# Altium project Aux-BMS.PrjPcb
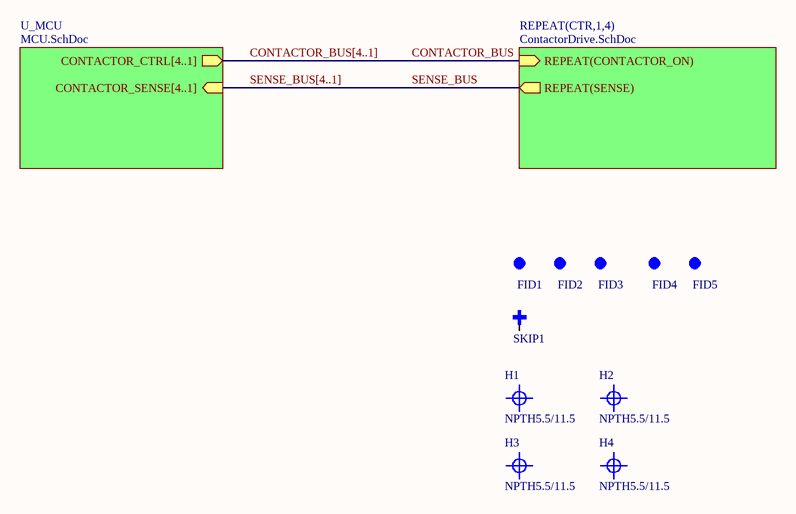
[diagram p0: MainSheet.SchDoc]
ProjectDocumentNumber: N/A; ProjectDrawnBy: DSG; ProjectOrganization: UofC Solar Car Team; ProjectRevHistory1: Initial Release; ProjectRevision: 1; ProjectStartDate: 2017-10-19; ProjectVersion: V01
3 sheets, 234 parts. Net scope: hierarchical (ports join the sheet entries above them; power ports are global).
Board file: Aux-BMS.PcbDoc
Sheets:
  MainSheet.SchDoc
    CTR1 = ContactorDrive.SchDoc
    CTR2 = ContactorDrive.SchDoc
    CTR3 = ContactorDrive.SchDoc
    CTR4 = ContactorDrive.SchDoc
    U_MCU = MCU.SchDoc

## Sheet MainSheet.SchDoc: Main
size A; SheetNumber: 1; SheetTotal: 3

### Parts
FID1  FIDUCIAL  [FID08]  (value not drawn)
FID2  FIDUCIAL  [FID08]  (value not drawn)
FID3  FIDUCIAL  [FID08]  (value not drawn)
FID4  FIDUCIAL  [FID08]  (value not drawn)
FID5  FIDUCIAL  [FID08]  (value not drawn)
H1  NPTH5.5/11.5  [NPTH5.5/11.5]  (no BOM)
H2  NPTH5.5/11.5  [NPTH5.5/11.5]  (no BOM)
H3  NPTH5.5/11.5  [NPTH5.5/11.5]  (no BOM)
H4  NPTH5.5/11.5  [NPTH5.5/11.5]  (no BOM)
SKIP1  X-Out/Skip Mark  [SKIP20-NOCOPPER]  (value not drawn)

### Sub-sheets
REPEAT(CTR,1,4) = ContactorDrive.SchDoc: REPEAT(CONTACTOR_ON) (in), REPEAT(SENSE) (out)
U_MCU = MCU.SchDoc: CONTACTOR_SENSE[4..1] (in), CONTACTOR_CTRL[4..1] (out)

### Nets

Not connected (* = marked no-connect by the designer): SKIP1 1

### Buses and harness runs
bus CONTACTOR_BUS[4..1] = sheet U_MCU/CONTACTOR_CTRL[4..1]
bus SENSE_BUS[4..1] = sheet U_MCU/CONTACTOR_SENSE[4..1]

### Notes on the sheet
- Revision History
- Rev:
- Description:
- Date:
- Title
- Size:
- Drawn By:
- D
- Number:
- Revision:
- Sheet
- of
- File:

### Library data of the parts
FID1-FID5 = FIDUCIAL: Alignment fiducial
H1-H4 = NPTH5.5/11.5: 5.5mm diameter hole, 11.5mm soldermask opening
SKIP1 = SKIP: X-Out/Skip Mark for bad board/do not populate

## Sheet ContactorDrive.SchDoc: Contactor Drive
size A; SheetNumber: 3; SheetTotal: 3
Used 4 times, as channels CTR1, CTR2, CTR3, CTR4. Parts and nets are listed once, with the designators drawn on the sheet.
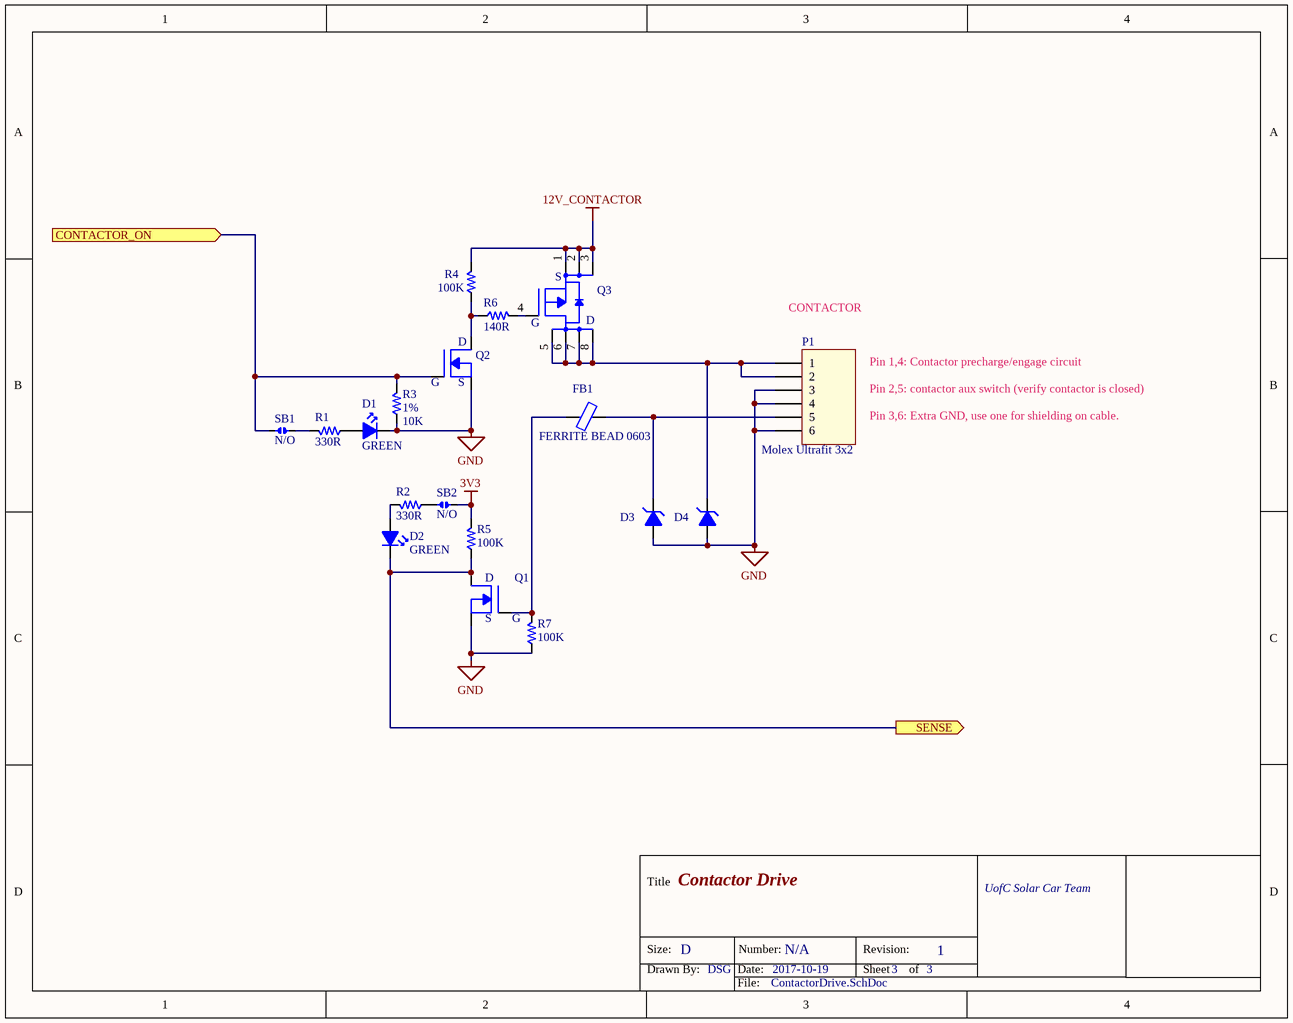
[diagram p1: ContactorDrive.SchDoc]

### Parts
D1  Color: GREEN  [SMD_0603_LED]  (hidden comment: D060-000G2-00)
D2  Color: GREEN  [SMD_0603_LED]  (hidden comment: D060-000G2-00)
D3  TVS_14V_UNI  [SODFL370X108-2N]  (value not drawn)
D4  TVS_14V_UNI  [SODFL370X108-2N]  (value not drawn)
FB1  FERRITE BEAD 0603  [INDC1608X10N]
P1  Molex Ultrafit 3x2  [Molex-Ultrafit-3x2]
Q1  NMOS - SSM3K333R  [NMOS - SSM3K333R - SOTFL95P180X88-3M]  (value not drawn)
Q2  NMOS - SSM3K333R  [NMOS - SSM3K333R - SOTFL95P180X88-3M]  (value not drawn)
Q3  INFINEON BSC030P03NS3 G  [BSC030P03NS3 G]  (value not drawn)
R1  value 330R  [PCB_GENERIC_SMD_0603]  (hidden comment: R060-00331-05)
R2  value 330R  [PCB_GENERIC_SMD_0603]  (hidden comment: R060-00331-05)
R3  value 10K  Tolerance: 1%  [PCB_GENERIC_SMD_0603]  (hidden comment: R060-00103-01)
R4  value 100K  [PCB_GENERIC_SMD_0603]  (hidden comment: R060-00104-05)
R5  value 100K  [PCB_GENERIC_SMD_0603]  (hidden comment: R060-00104-05)
R6  value 140R  [PCB_GENERIC_SMD_0603]  (hidden comment: R060-00141-05)
R7  value 100K  [PCB_GENERIC_SMD_0603]  (hidden comment: R060-00104-05)
SB1  N/O  [SB_ARROW_NC]  (no BOM)
SB2  N/O  [SB_ARROW_NC]  (no BOM)

### Ports
CONTACTOR_ON (in), SENSE (out)

### Nets
3V3: R5.2 SB2.2
12V_CONTACTOR: Q3.1(S) Q3.2(S) Q3.3(S) R4.2
GND: D1.1(K) D3.2(A) D4.2(A) P1.3 P1.4 P1.6 Q1.2(S) Q2.2(S) R3.1 R7.1
CONTACTOR_ON: Q2.1(G) R3.2 SB1.1 ; port CONTACTOR_ON
SENSE: D2.1(K) Q1.3(D) R5.1 ; port SENSE
NetD1_2: D1.2(A) R1.1
NetD2_2: D2.2(A) R2.2
NetD3_1: D3.1(C) FB1.2 P1.5
NetD4_1: D4.1(C) P1.1 P1.2 Q3.5(D) Q3.6(D) Q3.7(D) Q3.8(D)
NetFB1_1: FB1.1 Q1.1(G) R7.2
NetQ2_3: Q2.3(D) R4.1 R6.1
NetQ3_4: Q3.4(G) R6.2
NetR1_2: R1.2 SB1.2
NetR2_1: R2.1 SB2.1

### Channels
CTR1: designators end in A; ports CONTACTOR_ON=CONTACTOR_BUS1 SENSE=SENSE1
CTR2: designators end in B; ports CONTACTOR_ON=CONTACTOR_BUS2 SENSE=SENSE2
CTR3: designators end in C; ports CONTACTOR_ON=CONTACTOR_BUS3 SENSE=SENSE3
CTR4: designators end in D; ports CONTACTOR_ON=CONTACTOR_BUS4 SENSE=SENSE4

### Notes on the sheet
- (near P1) CONTACTOR
- Pin 1,4: Contactor precharge/engage circuit
- Pin 2,5: contactor aux switch (verify contactor is closed)
- Pin 3,6: Extra GND, use one for shielding on cable.
- Title
- Size:
- Drawn By:
- D
- Date:
- Number:
- Revision:
- Sheet
- of
- File:

### Library data of the parts
D1 D2 = D060-000G2-00: LED 0603 GREEN 3.2Vf 20mA; Supplier 1: Digi-Key; Supplier Part Number 1: 732-4971-1-ND
D3 D4 = TVS_14V_UNI: TVS DIODE 14VWM 23.2VC SMF; Supplier 1: Digi-Key; Supplier Part Number 1: SMF14A-E3-08GICT-ND
FB1 = 0603_FERRITE_600Ohm: Ferrite Bead, 0603, 600Ohm @ 100MHz, 200mOhm DC; Supplier 1: Digi-Key; Supplier 2: Newark; Supplier Part Number 1: MH1608-601YCT-ND; Supplier Part Number 2: 87W5975
P1 = Molex-Ultrafit-3x2: Molex Ultrafit 3x2 - 172299-1206
Q1 Q2 = NMOS - SSM3K333R: MOSFET N CH 30V 6A 2-3Z1A; Supplier 1: Digi-Key; Supplier Part Number 1: SSM3K333RLFDKR-ND
Q3 = BSC030P03NS3 G: P-Channel 30V 25.4A (Ta), 100A (Tc) 2.5W (Ta), 125W (Tc) Surface Mount PG-TDSON-8; Supplier 1: Digi-Key; Supplier Part Number 1: BSC030P03NS3 GCT-ND
R1 R2 = R060-00331-05: RES 0603 330ohm 5% 63mW; Tolerance: 5%; Power: 63mW; Package: 0603
R3 = R060-00103-01: RES 0603 10K 1% 100mW; Power: 100mW; Package: 0603
R4 R5 R7 = R060-00104-05: RES 0603 100K 5% 63mW; Tolerance: 5%; Power: 63mW; Package: 0603
R6 = R060-00141-05: RES 0603 140ohm 5% 63mW; Tolerance: 5%; Power: 63mW; Package: 0603
SB1 SB2 = SB_NO: Solder Bridge, Normally Open

## Sheet MCU.SchDoc: MCU
size D; SheetNumber: 2; SheetTotal: 3
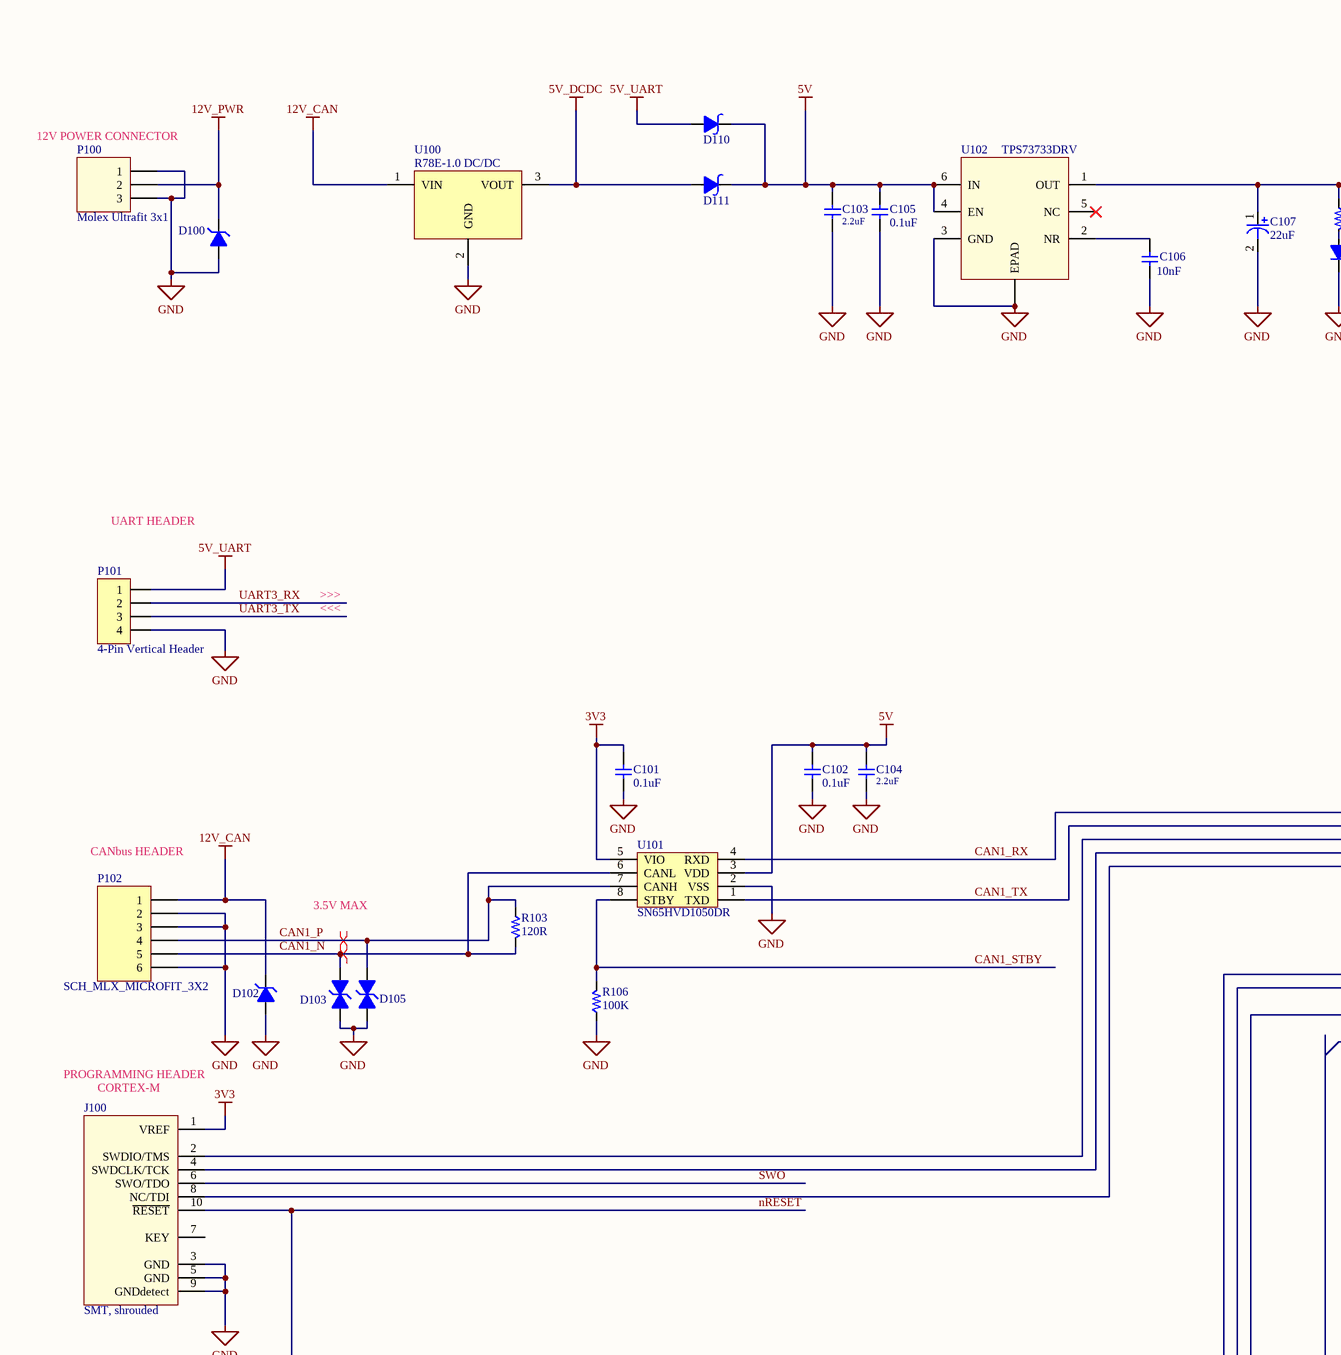
[diagram p2: MCU.SchDoc, top left]
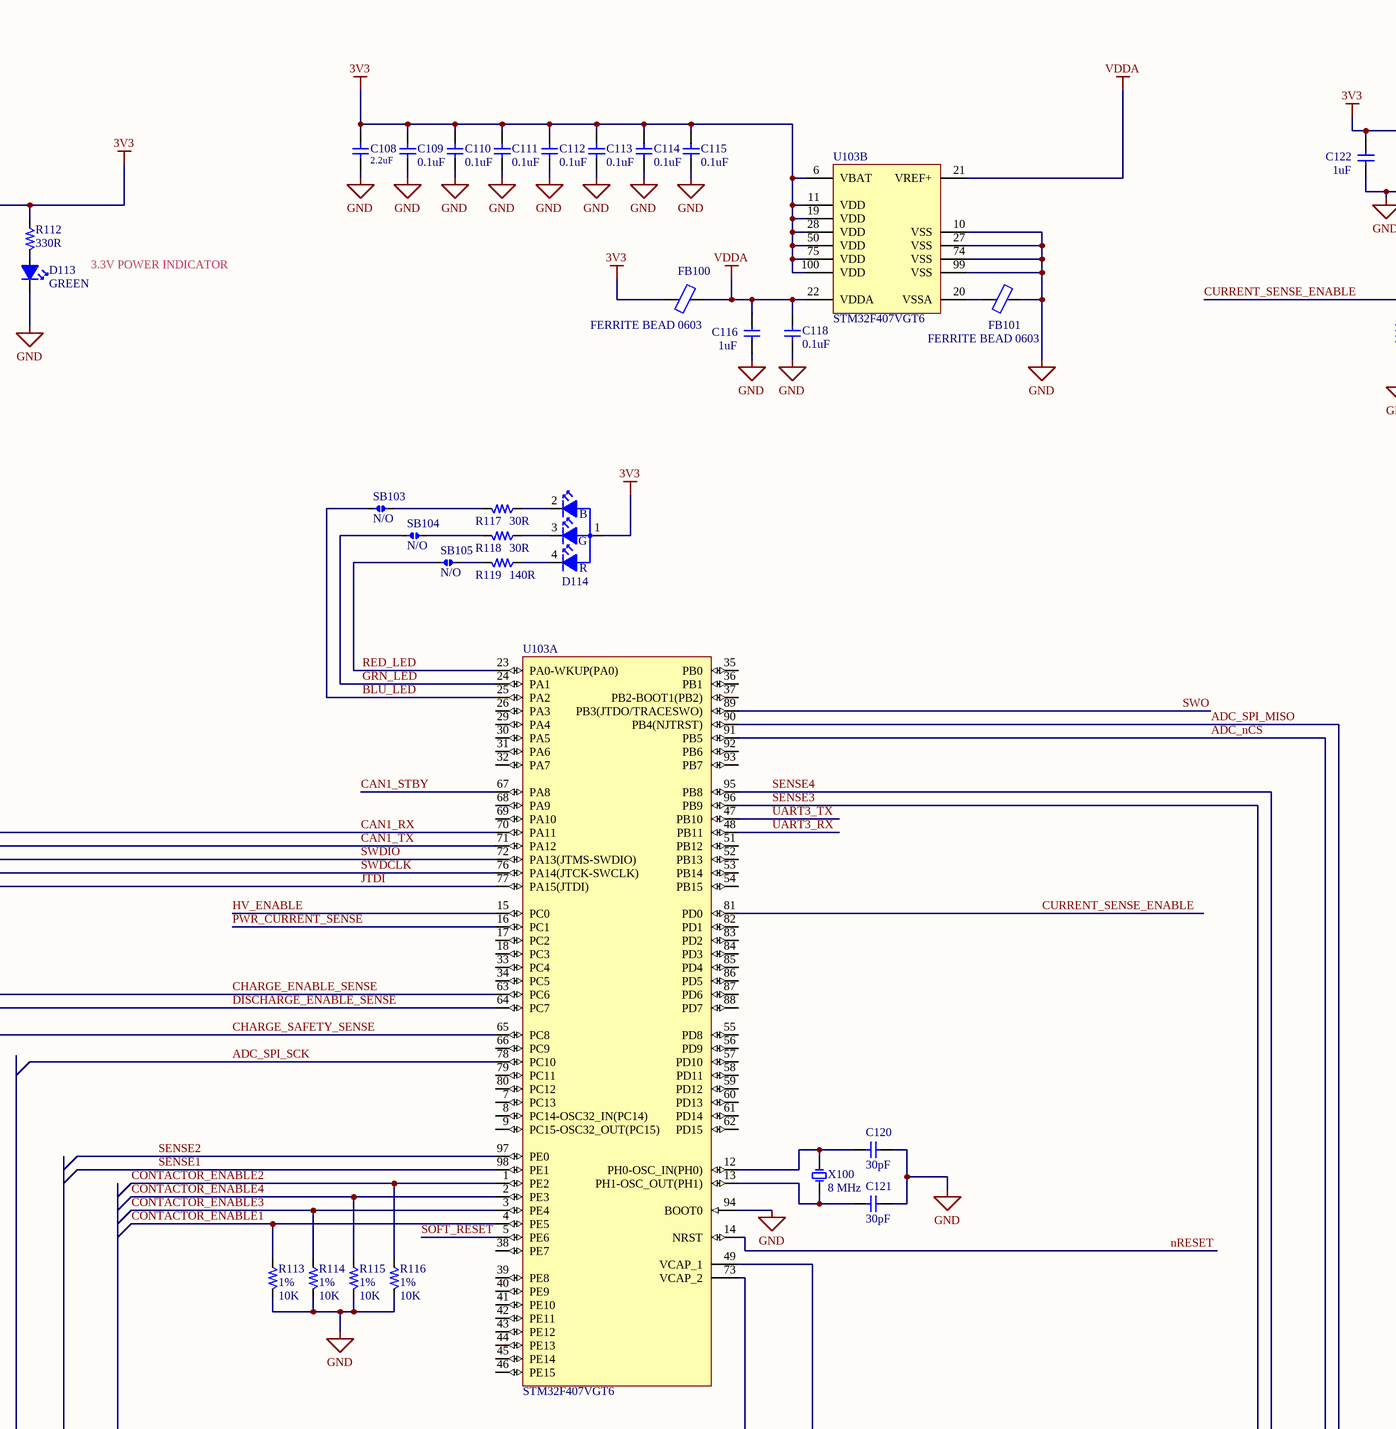
[diagram p3: MCU.SchDoc, top middle]
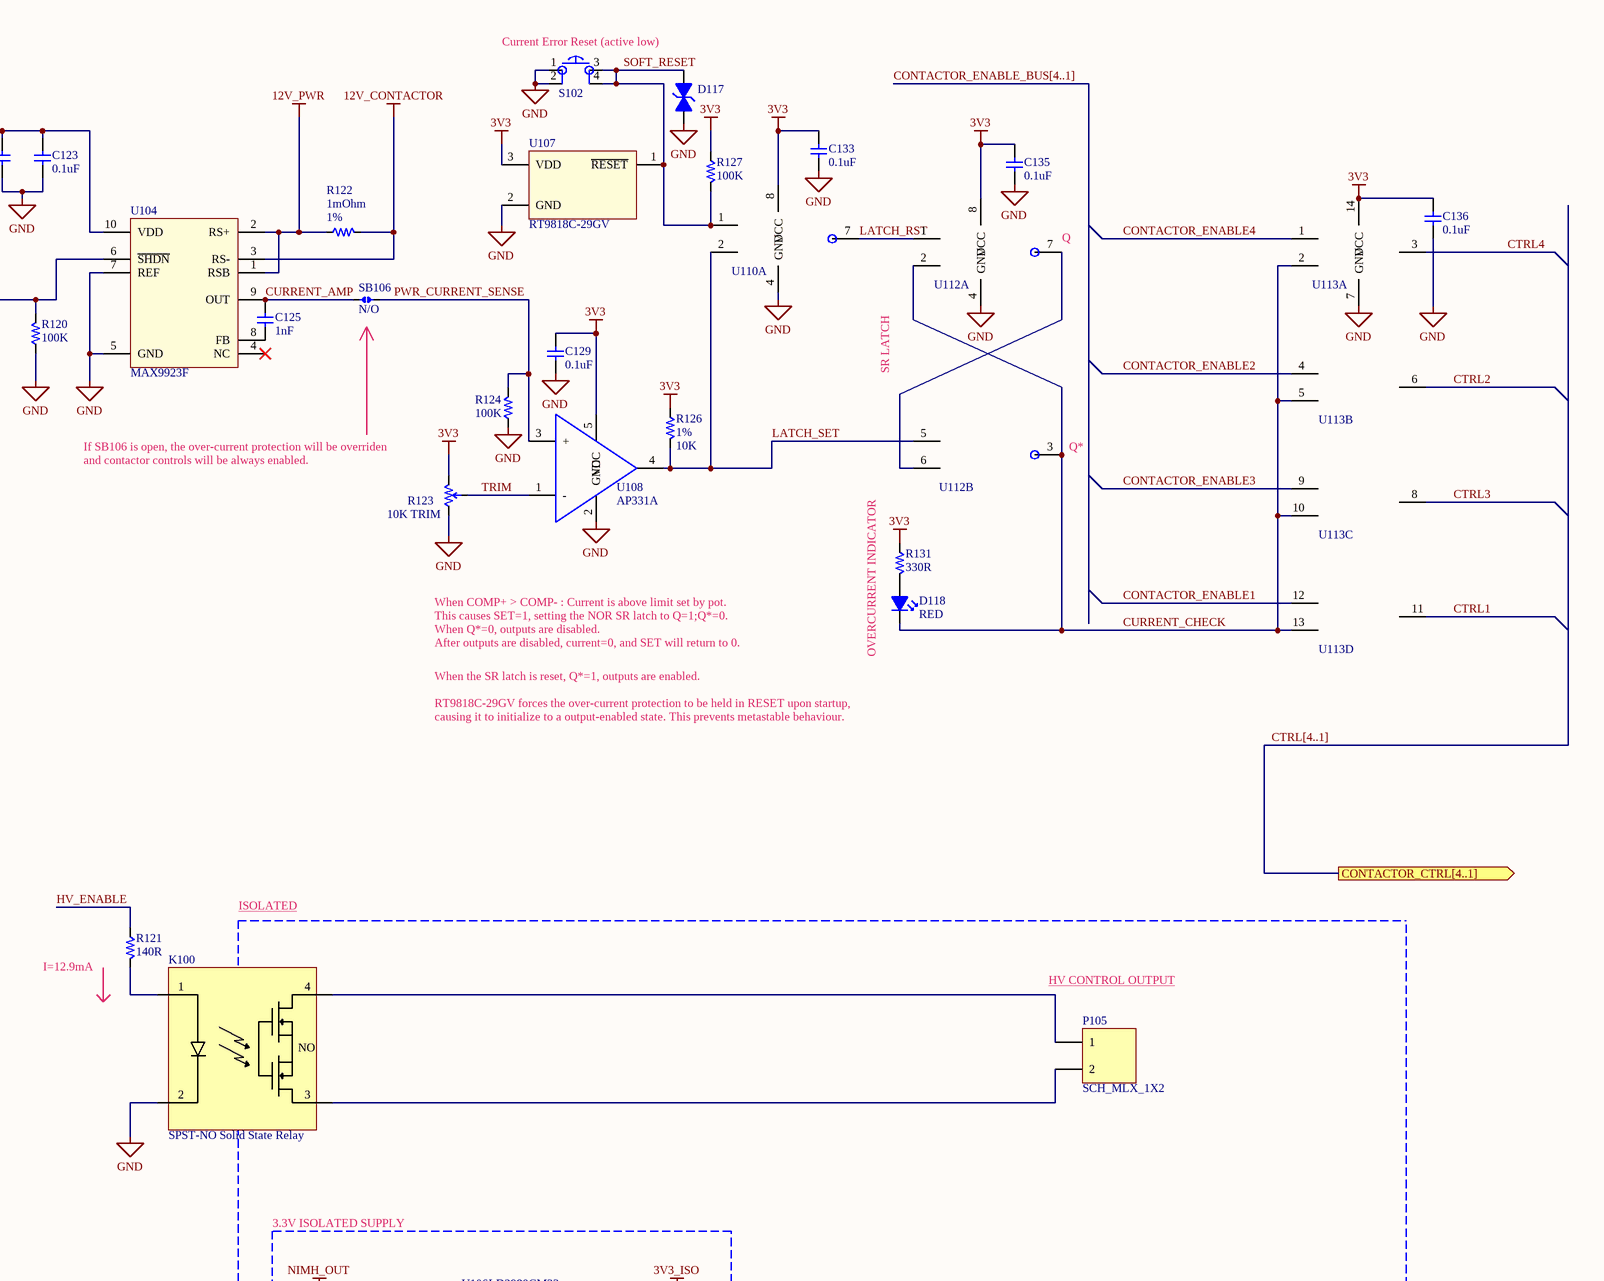
[diagram p4: MCU.SchDoc, top right]
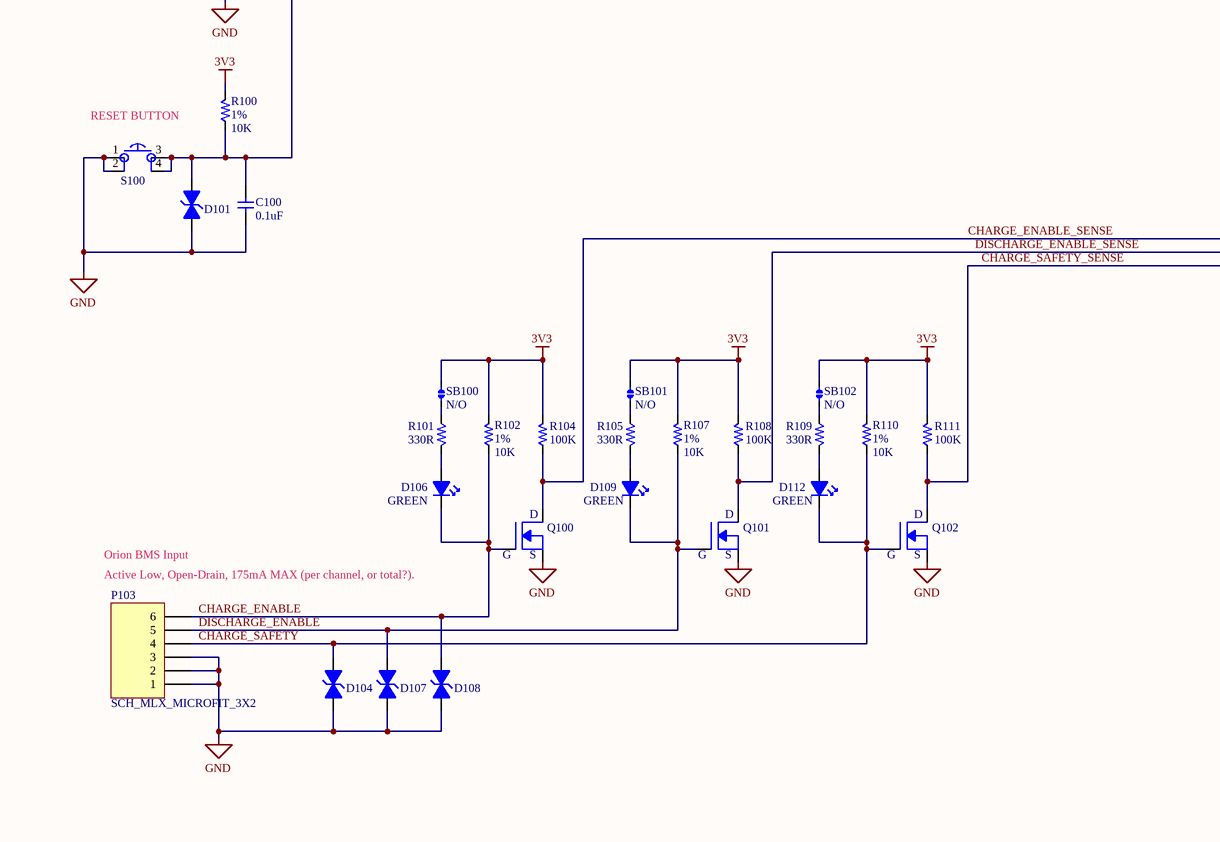
[diagram p5: MCU.SchDoc, bottom left]
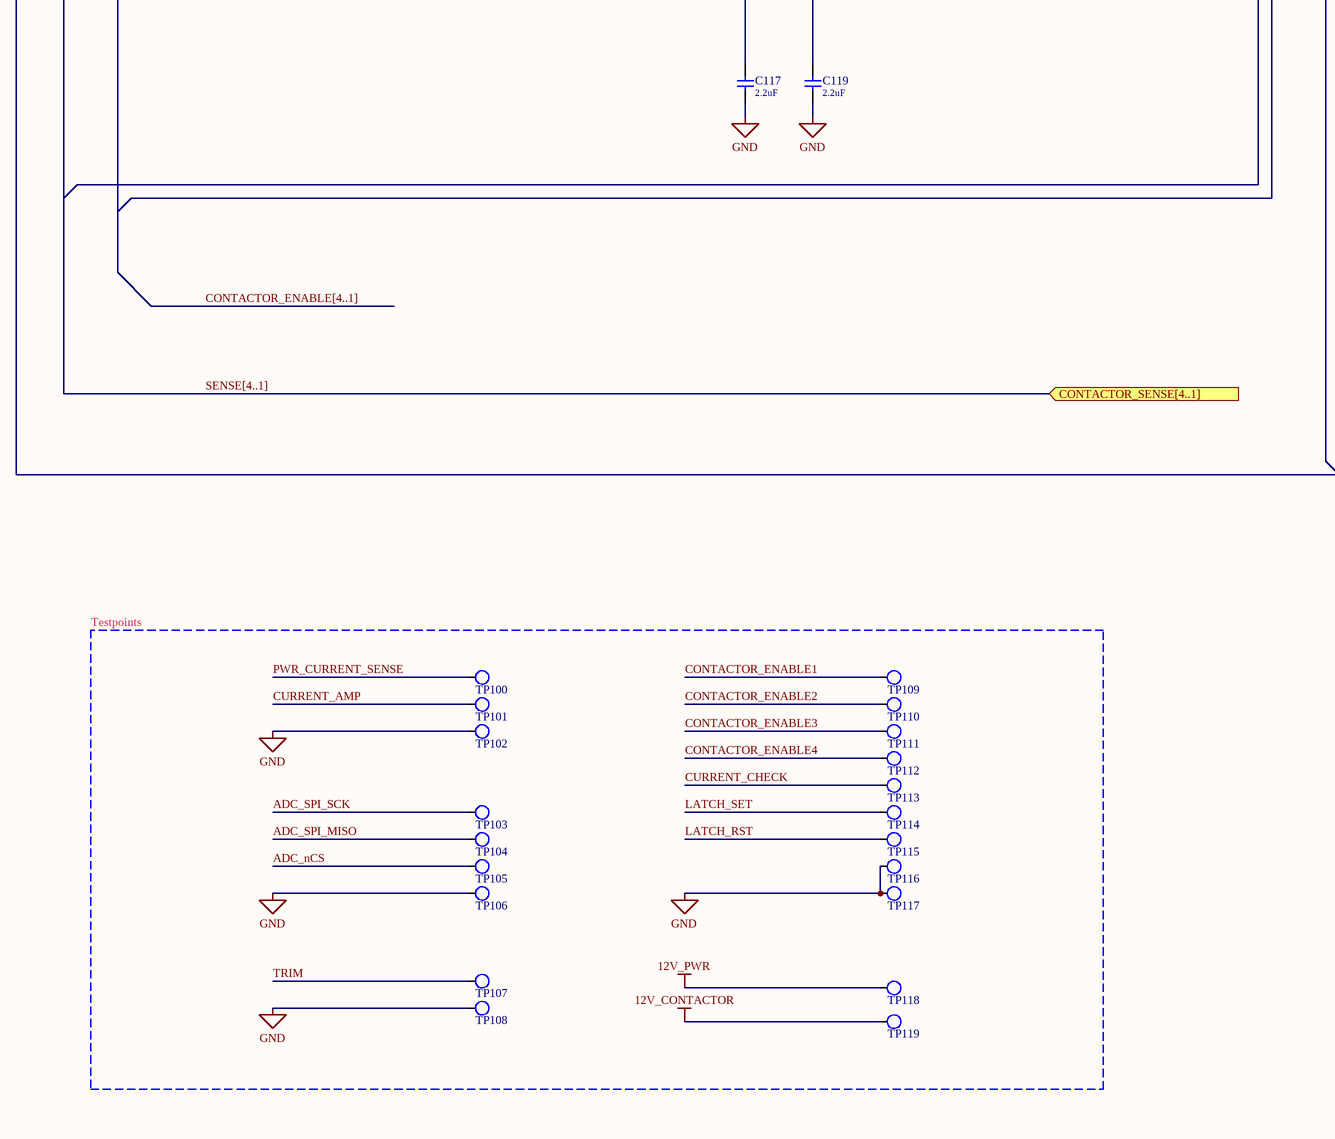
[diagram p6: MCU.SchDoc, bottom middle]
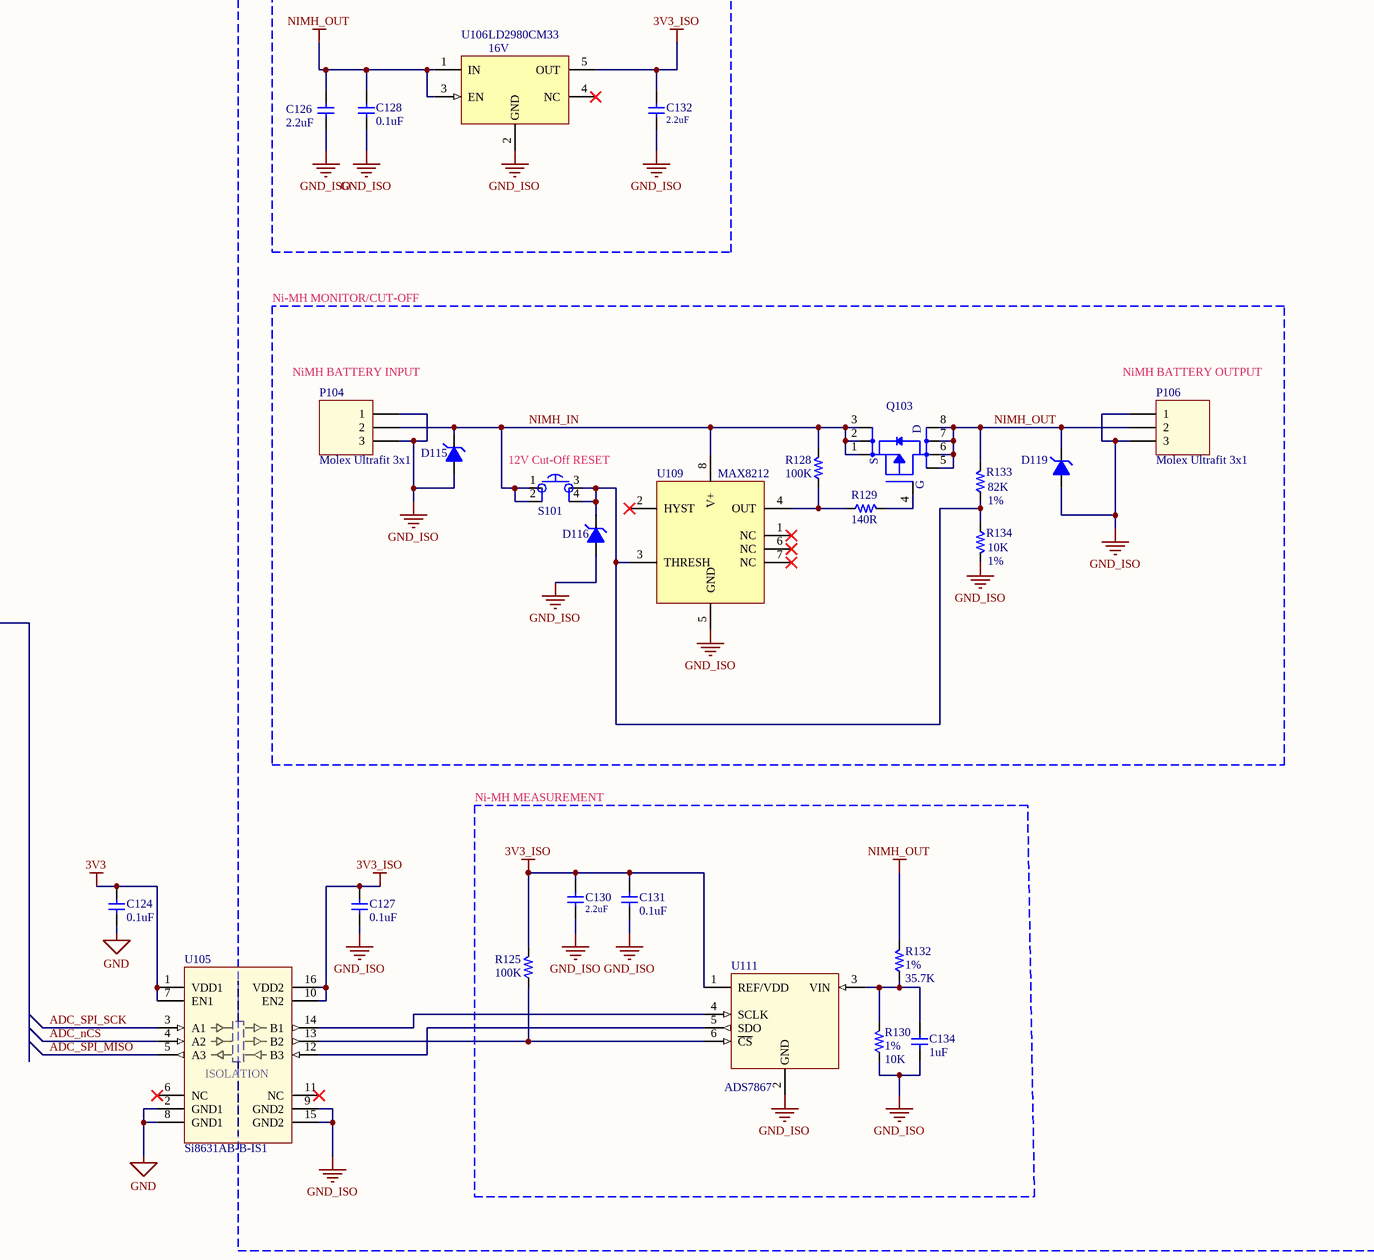
[diagram p7: MCU.SchDoc, bottom right]

### Parts
C100  value 0.1uF  [CAPC1005X06N]  (hidden comment: C040-000U1-00)
C101  value 0.1uF  [CAPC1005X06N]  (hidden comment: C040-000U1-00)
C102  value 0.1uF  [CAPC1005X06N]  (hidden comment: C040-000U1-00)
C103  value 2.2uF  [PCB_GENERIC_SMD_0603]  (hidden comment: C060-002U2-00)
C104  value 2.2uF  [PCB_GENERIC_SMD_0603]  (hidden comment: C060-002U2-00)
C105  value 0.1uF  [CAPC1005X06N]  (hidden comment: C040-000U1-00)
C106  value 10nF  [CAPC1005X06N]  (hidden comment: C040-0010N-00)
C107  value 22uF  [Tantalum-1206]  (hidden comment: C006-T022U-00)
C108  value 2.2uF  [PCB_GENERIC_SMD_0603]  (hidden comment: C060-002U2-00)
C109  value 0.1uF  [CAPC1005X06N]  (hidden comment: C040-000U1-00)
C110  value 0.1uF  [CAPC1005X06N]  (hidden comment: C040-000U1-00)
C111  value 0.1uF  [CAPC1005X06N]  (hidden comment: C040-000U1-00)
C112  value 0.1uF  [CAPC1005X06N]  (hidden comment: C040-000U1-00)
C113  value 0.1uF  [CAPC1005X06N]  (hidden comment: C040-000U1-00)
C114  value 0.1uF  [CAPC1005X06N]  (hidden comment: C040-000U1-00)
C115  value 0.1uF  [CAPC1005X06N]  (hidden comment: C040-000U1-00)
C116  value 1uF  [PCB_GENERIC_SMD_0603]  (hidden comment: C060-0001U-00)
C117  value 2.2uF  [PCB_GENERIC_SMD_0603]  (hidden comment: C060-002U2-00)
C118  value 0.1uF  [CAPC1005X06N]  (hidden comment: C040-000U1-00)
C119  value 2.2uF  [PCB_GENERIC_SMD_0603]  (hidden comment: C060-002U2-00)
C120  value 30pF  [CAPC1005X06N]  (hidden comment: C040-0030P-00)
C121  value 30pF  [CAPC1005X06N]  (hidden comment: C040-0030P-00)
C122  value 1uF  [PCB_GENERIC_SMD_0603]  (hidden comment: C060-0001U-00)
C123  value 0.1uF  [CAPC1005X06N]  (hidden comment: C040-000U1-00)
C124  value 0.1uF  [CAPC1005X06N]  (hidden comment: C040-000U1-00)
C125  value 1nF  [CAPC1005X06N]  (hidden comment: C040-0001N-00)
C126  value 2.2uF  [PCB_GENERIC_SMD_0603]  (hidden comment: C060-002U2-00)
C127  value 0.1uF  [CAPC1005X06N]  (hidden comment: C040-000U1-00)
C128  value 0.1uF  [CAPC1005X06N]  (hidden comment: C040-000U1-00)
C129  value 0.1uF  [CAPC1005X06N]  (hidden comment: C040-000U1-00)
C130  value 2.2uF  [PCB_GENERIC_SMD_0603]  (hidden comment: C060-002U2-00)
C131  value 0.1uF  [CAPC1005X06N]  (hidden comment: C040-000U1-00)
C132  value 2.2uF  [PCB_GENERIC_SMD_0603]  (hidden comment: C060-002U2-00)
C133  value 0.1uF  [CAPC1005X06N]  (hidden comment: C040-000U1-00)
C134  value 1uF  [PCB_GENERIC_SMD_0603]  (hidden comment: C060-0001U-00)
C135  value 0.1uF  [CAPC1005X06N]  (hidden comment: C040-000U1-00)
C136  value 0.1uF  [CAPC1005X06N]  (hidden comment: C040-000U1-00)
D100  TVS_14V_UNI  [SODFL370X108-2N]  (value not drawn)
D101  Bourns TVS Diode 3.3V SOD323  [TVS Diode SOD-323]  (value not drawn)
D102  TVS_14V_UNI  [SODFL370X108-2N]  (value not drawn)
D103  LittleFuse_SP4021-01FTG-C  [TVS Diode SOD-323]  (value not drawn)
D104  Bourns TVS Diode 3.3V SOD323  [TVS Diode SOD-323]  (value not drawn)
D105  LittleFuse_SP4021-01FTG-C  [TVS Diode SOD-323]  (value not drawn)
D106  Color: GREEN  [SMD_0603_LED]  (hidden comment: D060-000G2-00)
D107  Bourns TVS Diode 3.3V SOD323  [TVS Diode SOD-323]  (value not drawn)
D108  Bourns TVS Diode 3.3V SOD323  [TVS Diode SOD-323]  (value not drawn)
D109  Color: GREEN  [SMD_0603_LED]  (hidden comment: D060-000G2-00)
D110  ONSEMI_MBRM110LT1G  [ON Semi Schottky Diode - MBRM110LT1G]  (value not drawn)
D111  ONSEMI_MBRM110LT1G  [ON Semi Schottky Diode - MBRM110LT1G]  (value not drawn)
D112  Color: GREEN  [SMD_0603_LED]  (hidden comment: D060-000G2-00)
D113  Color: GREEN  [SMD_0603_LED]  (hidden comment: D060-000G2-00)
D114  D0S4-000CR-00  [CLMVB-FKA]  (value not drawn)
D115  TVS_14V_UNI  [SODFL370X108-2N]  (value not drawn)
D116  TVS_14V_UNI  [SODFL370X108-2N]  (value not drawn)
D117  Bourns TVS Diode 3.3V SOD323  [TVS Diode SOD-323]  (value not drawn)
D118  Color: RED  [SMD_0603_LED]  (hidden comment: D060-000R2-00)
D119  TVS_14V_UNI  [SODFL370X108-2N]  (value not drawn)
FB100  FERRITE BEAD 0603  [INDC1608X10N]
FB101  FERRITE BEAD 0603  [INDC1608X10N]
J100  SMT, shrouded  [CONN-50mil-10POS-SMD]
K100  SPST-NO Solid State Relay  [SPST-NO Solid State Relay - IXYS]
P100  Molex Ultrafit 3x1  [Molex-Ultrafit-3x1]
P101  4-Pin Vertical Header  [4-Pin Vertical Header]
P102  SCH_MLX_MICROFIT_3X2  [PCB_MLX_MICROFIT_3X2]
P103  SCH_MLX_MICROFIT_3X2  [PCB_MLX_MICROFIT_3X2]
P104  Molex Ultrafit 3x1  [Molex-Ultrafit-3x1]
P105  SCH_MLX_1X2  [PCB_MLX_MICROFIT_1X2]
P106  Molex Ultrafit 3x1  [Molex-Ultrafit-3x1]
Q100  NMOS - SSM3K333R  [NMOS - SSM3K333R - SOTFL95P180X88-3M]  (value not drawn)
Q101  NMOS - SSM3K333R  [NMOS - SSM3K333R - SOTFL95P180X88-3M]  (value not drawn)
Q102  NMOS - SSM3K333R  [NMOS - SSM3K333R - SOTFL95P180X88-3M]  (value not drawn)
Q103  INFINEON BSC030P03NS3 G  [BSC030P03NS3 G]  (value not drawn)
R100  value 10K  Tolerance: 1%  [PCB_GENERIC_SMD_0603]  (hidden comment: R060-00103-01)
R101  value 330R  [PCB_GENERIC_SMD_0603]  (hidden comment: R060-00331-05)
R102  value 10K  Tolerance: 1%  [PCB_GENERIC_SMD_0603]  (hidden comment: R060-00103-01)
R103  value 120R  [PCB_GENERIC_SMD_0603]  (hidden comment: R060-00121-05)
R104  value 100K  [PCB_GENERIC_SMD_0603]  (hidden comment: R060-00104-05)
R105  value 330R  [PCB_GENERIC_SMD_0603]  (hidden comment: R060-00331-05)
R106  value 100K  [PCB_GENERIC_SMD_0603]  (hidden comment: R060-00104-05)
R107  value 10K  Tolerance: 1%  [PCB_GENERIC_SMD_0603]  (hidden comment: R060-00103-01)
R108  value 100K  [PCB_GENERIC_SMD_0603]  (hidden comment: R060-00104-05)
R109  value 330R  [PCB_GENERIC_SMD_0603]  (hidden comment: R060-00331-05)
R110  value 10K  Tolerance: 1%  [PCB_GENERIC_SMD_0603]  (hidden comment: R060-00103-01)
R111  value 100K  [PCB_GENERIC_SMD_0603]  (hidden comment: R060-00104-05)
R112  value 330R  [PCB_GENERIC_SMD_0603]  (hidden comment: R060-00331-05)
R113  value 10K  Tolerance: 1%  [PCB_GENERIC_SMD_0603]  (hidden comment: R060-00103-01)
R114  value 10K  Tolerance: 1%  [PCB_GENERIC_SMD_0603]  (hidden comment: R060-00103-01)
R115  value 10K  Tolerance: 1%  [PCB_GENERIC_SMD_0603]  (hidden comment: R060-00103-01)
R116  value 10K  Tolerance: 1%  [PCB_GENERIC_SMD_0603]  (hidden comment: R060-00103-01)
R117  value 30R  [PCB_GENERIC_SMD_0603]  (hidden comment: R060-00300-05)
R118  value 30R  [PCB_GENERIC_SMD_0603]  (hidden comment: R060-00300-05)
R119  value 140R  [PCB_GENERIC_SMD_0603]  (hidden comment: R060-00141-05)
R120  value 100K  [PCB_GENERIC_SMD_0603]  (hidden comment: R060-00104-05)
R121  value 140R  [PCB_GENERIC_SMD_0603]  (hidden comment: R060-00141-05)
R122  Resistance: 1mOhm  Tolerance: 1%  [RESC6432X11N]  (hidden comment: resistor_sense_1mOhm_2512)
R123  10K TRIM  [10K_TRIM_SMD]
R124  value 100K  [PCB_GENERIC_SMD_0603]  (hidden comment: R060-00104-05)
R125  value 100K  [PCB_GENERIC_SMD_0603]  (hidden comment: R060-00104-05)
R126  value 10K  Tolerance: 1%  [PCB_GENERIC_SMD_0603]  (hidden comment: R060-00103-01)
R127  value 100K  [PCB_GENERIC_SMD_0603]  (hidden comment: R060-00104-05)
R128  value 100K  [PCB_GENERIC_SMD_0603]  (hidden comment: R060-00104-05)
R129  value 140R  [PCB_GENERIC_SMD_0603]  (hidden comment: R060-00141-05)
R130  value 10K  Tolerance: 1%  [PCB_GENERIC_SMD_0603]  (hidden comment: R060-00103-01)
R131  value 330R  [PCB_GENERIC_SMD_0603]  (hidden comment: R060-00331-05)
R132  value 35.7K  Tolerance: 1%  [PCB_GENERIC_SMD_0603]  (hidden comment: R060-03572-01)
R133  value 82K  Tolerance: 1%  [PCB_GENERIC_SMD_0603]  (hidden comment: R060-00823-01)
R134  value 10K  Tolerance: 1%  [PCB_GENERIC_SMD_0603]  (hidden comment: R060-00103-01)
S100  Tactile Switch  [C&K 4 pin Tactile Switch]  (value not drawn)
S101  Tactile Switch  [C&K 4 pin Tactile Switch]  (value not drawn)
S102  Tactile Switch  [C&K 4 pin Tactile Switch]  (value not drawn)
SB100  N/O  [SB_ARROW_NC]  (no BOM)
SB101  N/O  [SB_ARROW_NC]  (no BOM)
SB102  N/O  [SB_ARROW_NC]  (no BOM)
SB103  N/O  [SB_ARROW_NC]  (no BOM)
SB104  N/O  [SB_ARROW_NC]  (no BOM)
SB105  N/O  [SB_ARROW_NC]  (no BOM)
SB106  N/O  [SB_ARROW_NC]  (no BOM)
TP100  TESTPOINT  [TP08]  (value not drawn)  (no BOM)
TP101  TESTPOINT  [TP08]  (value not drawn)  (no BOM)
TP102  TESTPOINT  [TP08]  (value not drawn)  (no BOM)
TP103  TESTPOINT  [TP08]  (value not drawn)  (no BOM)
TP104  TESTPOINT  [TP08]  (value not drawn)  (no BOM)
TP105  TESTPOINT  [TP08]  (value not drawn)  (no BOM)
TP106  TESTPOINT  [TP08]  (value not drawn)  (no BOM)
TP107  TESTPOINT  [TP08]  (value not drawn)  (no BOM)
TP108  TESTPOINT  [TP08]  (value not drawn)  (no BOM)
TP109  TESTPOINT  [TP08]  (value not drawn)  (no BOM)
TP110  TESTPOINT  [TP08]  (value not drawn)  (no BOM)
TP111  TESTPOINT  [TP08]  (value not drawn)  (no BOM)
TP112  TESTPOINT  [TP08]  (value not drawn)  (no BOM)
TP113  TESTPOINT  [TP08]  (value not drawn)  (no BOM)
TP114  TESTPOINT  [TP08]  (value not drawn)  (no BOM)
TP115  TESTPOINT  [TP08]  (value not drawn)  (no BOM)
TP116  TESTPOINT  [TP08]  (value not drawn)  (no BOM)
TP117  TESTPOINT  [TP08]  (value not drawn)  (no BOM)
TP118  TESTPOINT  [TP08]  (value not drawn)  (no BOM)
TP119  TESTPOINT  [TP08]  (value not drawn)  (no BOM)
U100  R78E-1.0 DC/DC  [R78-1.0]
U101  SN65HVD1050DR  [SOIC127P600X175-8N]
U102  TPS73733DRV  [SON65P200X80_HS-7M]
U103  STM32F407VGT6  [STM-LQFP100_N]  (parts A,B of 2)
U104  MAX9923F  [TSSOP50P490X110-10N]
U105  Si8631AB-B-IS1  [SOIC127P600X175-16N]
U106  LD2980CM33  Voltage: 16V  [SOT95P280X145-5N]
U107  RT9818C-29GV  [SOT95P279X129-3N]
U108  AP331A  [SOT95P285X130-5N]
U109  MAX8212  [Maxim MAX8212]
U110  ONSEMI_NL27WZ02  [TSSOP50P310X90-8N]  (value not drawn)  (part A of 2)
U111  ADS7867  [SOT95P280X145-6N]
U112  ONSEMI_NL27WZ02  [TSSOP50P310X90-8N]  (value not drawn)  (parts A,B of 2)
U113  TI_SN74LV08A  [SOIC127P600X175-14N]  (value not drawn)  (parts A,B,C,D of 4)
X100  8 MHz  [CRYSTAL_8MHZ]

### Blocks framed on the sheet
3.3V ISOLATED SUPPLY: C126 C128 C132 U106
Testpoints: TP100-TP119
Ni-MH MEASUREMENT: C130 C131 C134 R125 R130 R132 U111

### Ports
CONTACTOR_CTRL[4..1] (out), CONTACTOR_SENSE[4..1] (in)

### Nets
3V3: C101.2 C107.1 C108.2 C109.2 C110.2 C111.2 C112.2 C113.2 C114.2 C115.2 C122.2 C123.2 C124.2 C129.2 C133.2 C135.2 C136.2 D114.1(Red) FB100.1 J100.1(VREF) R100.2 R102.2 R104.2 R107.2 R108.2 R110.2 R111.2 R112.1 R123.1 R126.1 R127.1 R131.1 SB100.2 SB101.2 SB102.2 U101.5(VIO) U102.1(OUT) U103.6(VBAT) U103.11(VDD) U103.19(VDD) U103.28(VDD) U103.50(VDD) U103.75(VDD) U103.100(VDD) U104.10(VDD) U105.1(VDD1) U105.7(EN1) U107.3(VDD) U108.5(VCC) U110.8(VCC) U112.8(VCC) U113.14(VCC)
3V3_ISO: C127.2 C130.2 C131.2 C132.2 R125.2 U105.10(EN2) U105.16(VDD2) U106.5(OUT) U111.1(REF/VDD)
5V: C102.2 C103.2 C104.2 C105.2 D110.1 D111.1 U101.3(VDD) U102.4(EN) U102.6(IN)
5V_DCDC: D111.2 U100.3(VOUT)
5V_UART: D110.2 P101.1
12V_CAN: D102.1(C) P102.1 U100.1(VIN)
12V_CONTACTOR: R122.2 TP119.1 U104.3(RS-)
12V_PWR: D100.1(C) P100.2 R122.1 TP118.1 U104.1(RSB) U104.2(RS+)
GND: C100.1 C101.1 C102.1 C103.1 C104.1 C105.1 C106.1 C107.2 C108.1 C109.1 C110.1 C111.1 C112.1 C113.1 C114.1 C115.1 C116.1 C117.1 C118.1 C119.1 C120.1 C121.1 C122.1 C123.1 C124.1 C129.1 C133.1 C135.1 C136.1 D100.2(A) D101.2 D102.2(A) D103.2 D104.2 D105.2 D107.2 D108.2 D113.1(K) D117.2 FB101.2 J100.3(GND) J100.5(GND) J100.9(GNDdetect) K100.2(Control_-) P100.1 P100.3 P101.4 P102.2 P102.3 P102.6 P103.1 P103.2 P103.3 Q100.2(S) Q101.2(S) Q102.2(S) R106.1 R113.2 R114.2 R115.2 R116.2 R120.1 R123.2 R124.1 S100.1 S100.2 S102.1 S102.2 TP102.1 TP106.1 TP108.1 TP116.1 TP117.1 U100.2(GND) U101.2(VSS) U102.3(GND) U102.7(EPAD) U103.10(VSS) U103.27(VSS) U103.74(VSS) U103.94(BOOT0) U103.99(VSS) U104.5(GND) U104.7(REF) U105.2(GND1) U105.8(GND1) U107.2(GND) U108.2(GND) U110.4(GND) U112.4(GND) U113.7(GND)
GND_ISO: C126.1 C127.1 C128.1 C130.1 C131.1 C132.1 C134.1 D115.2(A) D116.2(A) D119.2(A) P104.1 P104.3 P106.1 P106.3 R130.1 R134.2 U105.9(GND2) U105.15(GND2) U106.2(GND) U109.5(GND) U111.2(GND)
NIMH_OUT: C126.2 C128.2 D119.1(C) P106.2 Q103.5(D) Q103.6(D) Q103.7(D) Q103.8(D) R132.2 R133.2 U106.1(IN) U106.3(EN)
VDDA: C116.2 C118.2 FB100.2 U103.21(VREF+) U103.22(VDDA)
ADC_nCS: TP105.1 U103.91(PB5) U105.4(A2)
ADC_SPI_MISO: TP104.1 U103.90(PB4(NJTRST)) U105.5(A3)
ADC_SPI_SCK: TP103.1 U103.78(PC10) U105.3(A1)
BLU_LED: SB103.2 U103.25(PA2)
CAN1_N: D103.1 P102.5 R103.2 U101.6(CANL)
CAN1_P: D105.1 P102.4 R103.1 U101.7(CANH)
CAN1_RX: U101.4(RXD) U103.70(PA11)
CAN1_STBY: R106.2 U101.8(STBY) U103.67(PA8)
CAN1_TX: U101.1(TXD) U103.71(PA12)
CHARGE_ENABLE: D106.1(K) D108.1 P103.6 Q100.1(G) R102.1
CHARGE_ENABLE_SENSE: Q100.3(D) R104.1 U103.63(PC6)
CHARGE_SAFETY: D104.1 D112.1(K) P103.4 Q102.1(G) R110.1
CHARGE_SAFETY_SENSE: Q102.3(D) R111.1 U103.65(PC8)
CONTACTOR_ENABLE1: R113.1 TP109.1 U103.4(PE5) U113.12
CONTACTOR_ENABLE2: R116.1 TP110.1 U103.1(PE2) U113.4
CONTACTOR_ENABLE3: R114.1 TP111.1 U103.3(PE4) U113.9
CONTACTOR_ENABLE4: R115.1 TP112.1 U103.2(PE3) U113.1
CTRL1: U113.11  [project net CONTACTOR_BUS1]
CTRL2: U113.6  [project net CONTACTOR_BUS2]
CTRL3: U113.8  [project net CONTACTOR_BUS3]
CTRL4: U113.3  [project net CONTACTOR_BUS4]
CURRENT_AMP: C125.2 SB106.1 TP101.1 U104.9(OUT)
CURRENT_CHECK: D118.1(K) TP113.1 U112.2 U112.3 U113.2 U113.5 U113.10 U113.13
CURRENT_SENSE_ENABLE: R120.2 U103.81(PD0) U104.6(~{SHDN})
DISCHARGE_ENABLE: D107.1 D109.1(K) P103.5 Q101.1(G) R107.1
DISCHARGE_ENABLE_SENSE: Q101.3(D) R108.1 U103.64(PC7)
GRN_LED: SB104.2 U103.24(PA1)
HV_ENABLE: R121.1 U103.15(PC0)
JTDI: J100.8(NC/TDI) U103.77(PA15(JTDI))
LATCH_RST: TP115.1 U110.7 U112.1
LATCH_SET: R126.2 TP114.1 U108.4(VOUT) U110.2 U112.5
NIMH_IN: D115.1(C) P104.2 Q103.1(S) Q103.2(S) Q103.3(S) R128.2 S101.1 S101.2 U109.8(V+)
nRESET: C100.2 D101.1 J100.10(~{RESET}) R100.1 S100.3 S100.4 U103.14(NRST)
PWR_CURRENT_SENSE: R124.2 SB106.2 TP100.1 U103.16(PC1) U108.3(+)
RED_LED: SB105.2 U103.23(PA0-WKUP(PA0))
SENSE1: U103.98(PE1)
SENSE2: U103.97(PE0)
SENSE3: U103.96(PB9)
SENSE4: U103.95(PB8)
SOFT_RESET: D117.1 R127.2 S102.3 S102.4 U103.5(PE6) U107.1(~{RESET}) U110.1
SWDCLK: J100.4(SWDCLK/TCK) U103.76(PA14(JTCK-SWCLK))
SWDIO: J100.2(SWDIO/TMS) U103.72(PA13(JTMS-SWDIO))
SWO: J100.6(SWO/TDO) U103.89(PB3(JTDO/TRACESWO))
TRIM: R123.3 TP107.1 U108.1(-)
UART3_RX: P101.2 U103.48(PB11)
UART3_TX: P101.3 U103.47(PB10)
NetC106_2: C106.2 U102.2(NR)
NetC117_2: C117.2 U103.73(VCAP_2)
NetC119_2: C119.2 U103.49(VCAP_1)
NetC120_2: C120.2 U103.12(PH0-OSC_IN(PH0)) X100.2
NetC121_2: C121.2 U103.13(PH1-OSC_OUT(PH1)) X100.1
NetC125_1: C125.1 U104.8(FB)
NetC134_2: C134.2 R130.2 R132.1 U111.3(VIN)
NetD106_2: D106.2(A) R101.2
NetD109_2: D109.2(A) R105.2
NetD112_2: D112.2(A) R109.2
NetD113_2: D113.2(A) R112.2
NetD114_2: D114.2(Green) R117.1
NetD114_3: D114.3(Blue) R118.1
NetD114_4: D114.4 R119.1
NetD116_1: D116.1(C) R133.1 R134.1 S101.3 S101.4 U109.3(THRESH)
NetD118_2: D118.2(A) R131.2
NetFB101_1: FB101.1 U103.20(VSSA)
NetK100_1: K100.1(Control_+) R121.2
NetK100_3: K100.3(Load) P105.2
NetK100_4: K100.4(Load) P105.1
NetQ103_4: Q103.4(G) R129.2
NetR101_1: R101.1 SB100.1
NetR105_1: R105.1 SB101.1
NetR109_1: R109.1 SB102.1
NetR117_2: R117.2 SB103.1
NetR118_2: R118.2 SB104.1
NetR119_2: R119.2 SB105.1
NetR125_1: R125.1 U105.13(B2) U111.6(~{CS})
NetR128_1: R128.1 R129.1 U109.4(OUT)
NetU105_12: U105.12(B3) U111.5(SDO)
NetU105_14: U105.14(B1) U111.4(SCLK)
NetU112_6: U112.6 U112.7

Not connected (* = marked no-connect by the designer): J100 7(KEY); U102 5(NC)*; U103 7(PC13) 8(PC14-OSC32_IN(PC14)) 9(PC15-OSC32_OUT(PC15)) 17(PC2) 18(PC3) 26(PA3) 29(PA4) 30(PA5) 31(PA6) 32(PA7) 33(PC4) 34(PC5) 35(PB0) 36(PB1) 37(PB2-BOOT1(PB2)) 38(PE7) 39(PE8) 40(PE9) 41(PE10) 42(PE11) 43(PE12) 44(PE13) 45(PE14) 46(PE15) 51(PB12) 52(PB13) 53(PB14) 54(PB15) 55(PD8) 56(PD9) 57(PD10) 58(PD11) 59(PD12) 60(PD13) 61(PD14) 62(PD15) 66(PC9) 68(PA9) 69(PA10) 79(PC11) 80(PC12) 82(PD1) 83(PD2) 84(PD3) 85(PD4) 86(PD5) 87(PD6) 88(PD7) 92(PB6) 93(PB7); U104 4(NC)*; U105 6(NC)* 11(NC)*; U106 4(NC)*; U109 1(NC)* 2(HYST)* 6(NC)* 7(NC)*

### Buses and harness runs
bus CONTACTOR_ENABLE[4..1]
bus CONTACTOR_ENABLE_BUS[4..1]
bus CTRL[4..1] = port CONTACTOR_CTRL[4..1]
bus SENSE[4..1] = port CONTACTOR_SENSE[4..1]

### Layout directives
differential pair: CAN1_N, CAN1_P

### Notes on the sheet
- Current Error Reset (active low)
- (near P100) 12V POWER CONNECTOR
- 3.3V POWER INDICATOR
- (near U112) Q
- SR LATCH
- (near R123) If SB106 is open, the over-current protection will be overriden
- and contactor controls will be always enabled.
- (near U112) Q*
- UART HEADER
- >>>
- When COMP+ > COMP- : Current is above limit set by pot.
- This causes SET=1, setting the NOR SR latch to Q=1;Q*=0.
- <<<
- When Q*=0, outputs are disabled.
- When the SR latch is reset, Q*=1, outputs are enabled.
- After outputs are disabled, current=0, and SET will return to 0.
- OVERCURRENT INDICATOR
- RT9818C-29GV forces the over-current protection to be held in RESET upon startup,
- causing it to initialize to a output-enabled state. This prevents metastable behaviour.
- (near P102) CANbus HEADER
- 3.5V MAX
- ISOLATED
- (near R121) I=12.9mA
- HV CONTROL OUTPUT
- (near J100) PROGRAMMING HEADER
- (near J100) CORTEX-M
- (near S100) RESET BUTTON
- Ni-MH MONITOR/CUT-OFF
- (near P104) NiMH BATTERY INPUT
- (near P106) NiMH BATTERY OUTPUT
- (near S101) 12V Cut-Off RESET
- Orion BMS Input
- (near P103) Active Low, Open-Drain, 175mA MAX (per channel, or total?).
- Title
- Size:
- Drawn By:
- D
- File:
- Date:
- Number:
- Revision:
- Sheet
- of
- (in symbol D0S4-000CR-00) B; G; R
- (in symbol SL_Si8631_NSOIC16) ISOLATION
- (in symbol SPST-NO Solid State Relay) NO

### Library data of the parts
C100-C102 C105 C109-C115 C118 C123 C124 C127-C129 C131 C133 C135 C136 = C040-000U1-00: CAP CER 0402 0.1uF 10V X5R 10%; Tolerance: 10%; Voltage: 10V; Package: 0402
C103 C104 C108 C117 C119 C126 C130 C132 = C060-002U2-00: CAP CER 0603 2.2uF 16V X5R 20%; Tolerance: 20%; Voltage: 16V; Package: 0603
C106 = C040-0010N-00: CAP CER 0402 10nF 50V X7R 10%; Tolerance: 10%; Voltage: 50V; Package: 0402
C107 = C006-T022U-00: CAP TANT 1206 22uF 6.3V 2.5ohm 20%; Voltage: 6.3V; Package: Molded 1206; Tolerance: 20%; Supplier 1: Digi-Key; Supplier Part Number 1: 478-8164-1-ND
C116 C122 C134 = C060-0001U-00: CAP CER 0603 1uF 16V X5R 20%; Tolerance: 20%; Voltage: 16V; Package: 0603
C120 C121 = C040-0030P-00: CAP CER 0402 30pF 25V NP0 5%; Tolerance: 5%; Voltage: 25V; Package: 0402
C125 = C040-0001N-00: CAP CER 0402 1nF 50V X7R 10%; Tolerance: 10%; Voltage: 50V; Package: 0402
D100 D102 D115 D116 D119 = TVS_14V_UNI: TVS DIODE 14VWM 23.2VC SMF; Supplier 1: Digi-Key; Supplier Part Number 1: SMF14A-E3-08GICT-ND
D101 D104 D107 D108 D117 = Bourns TVS Diode 3.3V SOD323: TVS DIODE 3.3VWM 10.9VC SOD323; Supplier 1: Digi-Key; Supplier Part Number 1: CDSOD323-T03SCCT-ND
D103 D105 = LittleFuse_SP4021-01FTG-C: TVS DIODE 5VWM 19.6VC BI SOD323; Supplier 1: Digi-Key; Supplier Part Number 1: F6273CT-ND
D106 D109 D112 D113 = D060-000G2-00: LED 0603 GREEN 3.2Vf 20mA; Supplier 1: Digi-Key; Supplier Part Number 1: 732-4971-1-ND
D110 D111 = ONSEMI_MBRM110LT1G: DIODE SCHOTTKY 10V 1A; Supplier 1: Digi-Key; Supplier Part Number 1: MBRM110LT1GOSDKR-ND
D114 = D0S4-000CR-00: LED 4SMD RGB 2Vf 3Vf 3Vf 20mA 10mA 10mA; Supplier 1: Digi-Key; Supplier Part Number 1: CLMVB-FKA-CFHEHLCBB7A363CT-ND; Color: RGB
D118 = D060-000R2-00: LED 0603 RED 2Vf 20mA; Supplier 1: Digi-Key; Supplier Part Number 1: 732-4978-1-ND
FB100 FB101 = 0603_FERRITE_600Ohm: as FB1 on sheet ContactorDrive; Supplier 1: Digi-Key; Supplier 2: Newark; Supplier Part Number 1: MH1608-601YCT-ND; Supplier Part Number 2: 87W5975
J100 = conn_0.050"_cortexM: ARM Cortex-M 10pin connector,shrouded,SMT; Supplier 1: Digi-Key; Supplier Part Number 1: 1175-1629-ND
P100 P104 P106 = Molex-Ultrafit-3x1: Molex Ultrafit 3x1 - 172310-1303
P101 = 4-Pin Vertical Header: Manufacturer: Sullins; Manufacturer No.: PPPC041LFBN-RC
Q100-Q102 = NMOS - SSM3K333R: MOSFET N CH 30V 6A 2-3Z1A; Supplier 1: Digi-Key; Supplier Part Number 1: SSM3K333RLFDKR-ND
Q103 = BSC030P03NS3 G: as Q3 on sheet ContactorDrive; Supplier 1: Digi-Key; Supplier Part Number 1: BSC030P03NS3 GCT-ND
R100 R102 R107 R110 R113-R116 R126 R130 R134 = R060-00103-01: RES 0603 10K 1% 100mW; Power: 100mW; Package: 0603
R101 R105 R109 R112 R131 = R060-00331-05: RES 0603 330ohm 5% 63mW; Tolerance: 5%; Power: 63mW; Package: 0603
R103 = R060-00121-05: RES 0603 120ohm 5% 63mW; Tolerance: 5%; Power: 63mW; Package: 0603
R104 R106 R108 R111 R120 R124 R125 R127 R128 = R060-00104-05: RES 0603 100K 5% 63mW; Tolerance: 5%; Power: 63mW; Package: 0603
R117 R118 = R060-00300-05: RES 0603 30ohm 5% 100mW; Tolerance: 5%; Power: 100mW; Package: 0603
R119 R121 R129 = R060-00141-05: RES 0603 140ohm 5% 63mW; Tolerance: 5%; Power: 63mW; Package: 0603
R122 = resistor_sense_1mOhm_2512: 1mOhm Current Sense; Supplier 1: Digi-Key; Supplier Part Number 1: P1.0NDCT-ND
R123 = 10K_TRIM_SMD: TRIMMER 10K OHM 0.25W SMD; Supplier 1: Digikey; Supplier Part Number 1: ST4ETA103CT-ND
R132 = R060-03572-01: RES 0603 35.7K 1% 100mW; Power: 100mW; Package: 0603
R133 = R060-00823-01: RES 0603 82K 1% 100mW; Power: 100mW; Package: 0603
S100-S102 = C&K Tactile Switch: Supplier 1: Digi-Key; Supplier Part Number 1: CKN9085CT-ND
SB100-SB106 = SB_NO: Solder Bridge, Normally Open
U100 = R78E-1.0
U101 = SN65HVD1050DR: IC EMC CAN TRANSCEIVER 8-SOIC; Supplier 1: Digi-Key; Supplier Part Number 1: 296-26335-1-ND
U102 = TPS73733DRV: IC REG LDO 3.3V 1A 6SON; Supplier 1: Digikey; Supplier Part Number 1: 296-40960-1-ND
U103 = STM32F407VGT6: ARM Cortex-M4 32-bit MCU+FPU, 210 DMIPS, 1024 kB Flash, 192 kB Internal RAM, 82 I/Os, 100-pin LQFP, -40 to 85 degC, Tray; Manufacturer: STMicroelectronics; D/A Converter: 2x12-bit; FLASH Size (Prog) (kB): 1024; I/Os (High Current): 82; Internal RAM Size (kB): 192; Operating Frequency(F) (Processor speed) (MHz): 168; Supply Voltage(Vcc) max (V): 3.6; Supply Voltage(Vcc) min (V): 1.8; DatasheetVersion: Rev. 4; PackageVersion: Rev. 1, 06/2013; PackageReference: LQFP100; PackageDescription: 100-Pin Low Profile Quad Flat Package, 14 x 14 mm Body, 0.5 mm Pitch; Supplier 1: Digi-Key; Supplier Part Number 1: 497-11605-ND; Supplier 2: Farnell; Supplier Part Number 2: 2064368; Supplier 3: Newark; Supplier Part Number 3: 73T2333; Supplier 4: Mouser; Supplier Part Number 4: 511-STM32F407VGT6; Core: ARM Cortex-M4; Packing: Tray; Mounting Technology: Surface Mount; PartNumber: STM32F407VGT6; ComponentLink1Description: Manufacturer URL; ComponentLink1URL: http://www.st.com/web/en/home.html; ComponentLink2Description: Datasheet; ComponentLink2URL: http://www.st.com/st-web-ui/static/active/en/resource/technical/document/datasheet/DM00037051.pdf; ComponentLink3Description: Package Specification; ComponentLink3URL: http://www.st.com/st-web-ui/static/active/en/resource/technical/document/data_brief/DM00071938.pdf
U104 = MAX9923F-10MSOP: IC OPAMP CURR SENS 2.5KHZ 250V/V GAIN; Supplier 1: Digi-Key; Supplier Part Number 1: MAX9923FEUB+-ND
U105 = SL_Si8631_NSOIC16: 2/1 Channel Digital Isolator; Supplier 1: Digi-Key; Supplier Part Number 1: SI8631AB-B-IS1-ND
U106 = LD2980CM33: IC REG LDO 3.3V 50MA SOT23-5; Supplier 1: Digi-Key; Supplier Part Number 1: 497-3479-1-ND
U107 = RT9818C-29GV: IC VOLT DETECTOR 2.9V SOT23-3; Supplier 1: Digi-Key; Supplier Part Number 1: 1028-1020-1-ND
U108 = AP331A: Single Channel Comparator, Open Drain, SC-74A/SOT-753; Supplier 1: Digikey; Supplier Part Number 1: AP331AWGDICT-ND
U109 = Maxim MAX8212: Supplier 1: Digi-Key; Supplier Part Number 1: MAX8212CSA+-ND
U110 U112 = ONSEMI_NL27WZ02: 2CH 2IN NOR; Supplier 1: Digikey; Supplier Part Number 1: NL27WZ02USGOSDKR-ND
U111 = ADS7867_SOT23-6: ADC 10BIT 240KSPS SOT23-6; Supplier 1: Digi-Key; Supplier Part Number 1: 296-18217-1-ND
U113 = TI_SN74LV08A: AND GATE 4CH 2IN SOIC14; Supplier 1: Digikey; Supplier Part Number 1: 296-26531-6-ND
X100 = XTAL_TH_8MHz: 8MHz ±30ppm 20pF Crystal; Frequency: 8MHz; Supplier 1: Digi-Key; Supplier Part Number 1: 631-1100-ND

## Nets that join several sheets
3V3: CTR1 (R5A.2 SB2A.2), CTR2 (R5B.2 SB2B.2), CTR3 (R5C.2 SB2C.2), CTR4 (R5D.2 SB2D.2), MCU (52 pins)
12V_CONTACTOR: CTR1 (Q3A.1 Q3A.2 Q3A.3 R4A.2), CTR2 (Q3B.1 Q3B.2 Q3B.3 R4B.2), CTR3 (Q3C.1 Q3C.2 Q3C.3 R4C.2), CTR4 (Q3D.1 Q3D.2 Q3D.3 R4D.2), MCU (R122.2 TP119.1 U104.3)
GND: CTR1 (10 pins), CTR2 (10 pins), CTR3 (10 pins), CTR4 (10 pins), MCU (91 pins)
CONTACTOR_BUS1: CTR1 (Q2A.1 R3A.2 SB1A.1), MCU (U113.11)
CONTACTOR_BUS2: CTR2 (Q2B.1 R3B.2 SB1B.1), MCU (U113.6)
CONTACTOR_BUS3: CTR3 (Q2C.1 R3C.2 SB1C.1), MCU (U113.8)
CONTACTOR_BUS4: CTR4 (Q2D.1 R3D.2 SB1D.1), MCU (U113.3)
SENSE1: CTR1 (D2A.1 Q1A.3 R5A.1), MCU (U103.98)
SENSE2: CTR2 (D2B.1 Q1B.3 R5B.1), MCU (U103.97)
SENSE3: CTR3 (D2C.1 Q1C.3 R5C.1), MCU (U103.96)
SENSE4: CTR4 (D2D.1 Q1D.3 R5D.1), MCU (U103.95)

## Assembly variants
PCBway: not fitted C106 C107 C116 C120 C121 C122 C125 C134 D103 D105 D110 D111 D114 D118 K100 P1A P1B P1C P1D P100 P101 P102 P103 P104 P105 P106 R103 R117 R118 R122 R123 R132 R133 S100 S101 S102 U100 U101 U105 U106 U107 U108 U109 U111 U113 X100
MacroFab: not fitted H1 H2 H3 H4 P1A P1B P1C P1D P100 P101 P102 P103 P104 P105 P106 R103 SB1A SB1B SB1C SB1D SB2A SB2B SB2C SB2D SB100 SB101 SB102 SB103 SB104 SB105 SB106 SKIP1 TP100 TP101 TP102 TP103 TP104 TP105 TP106 TP107 TP108 TP109 TP110 TP111 TP112 TP113 TP114 TP115 TP116 TP117 TP118 TP119 U100 X100